# EAGLE design sensor_board (EAGLE 7.2.0)
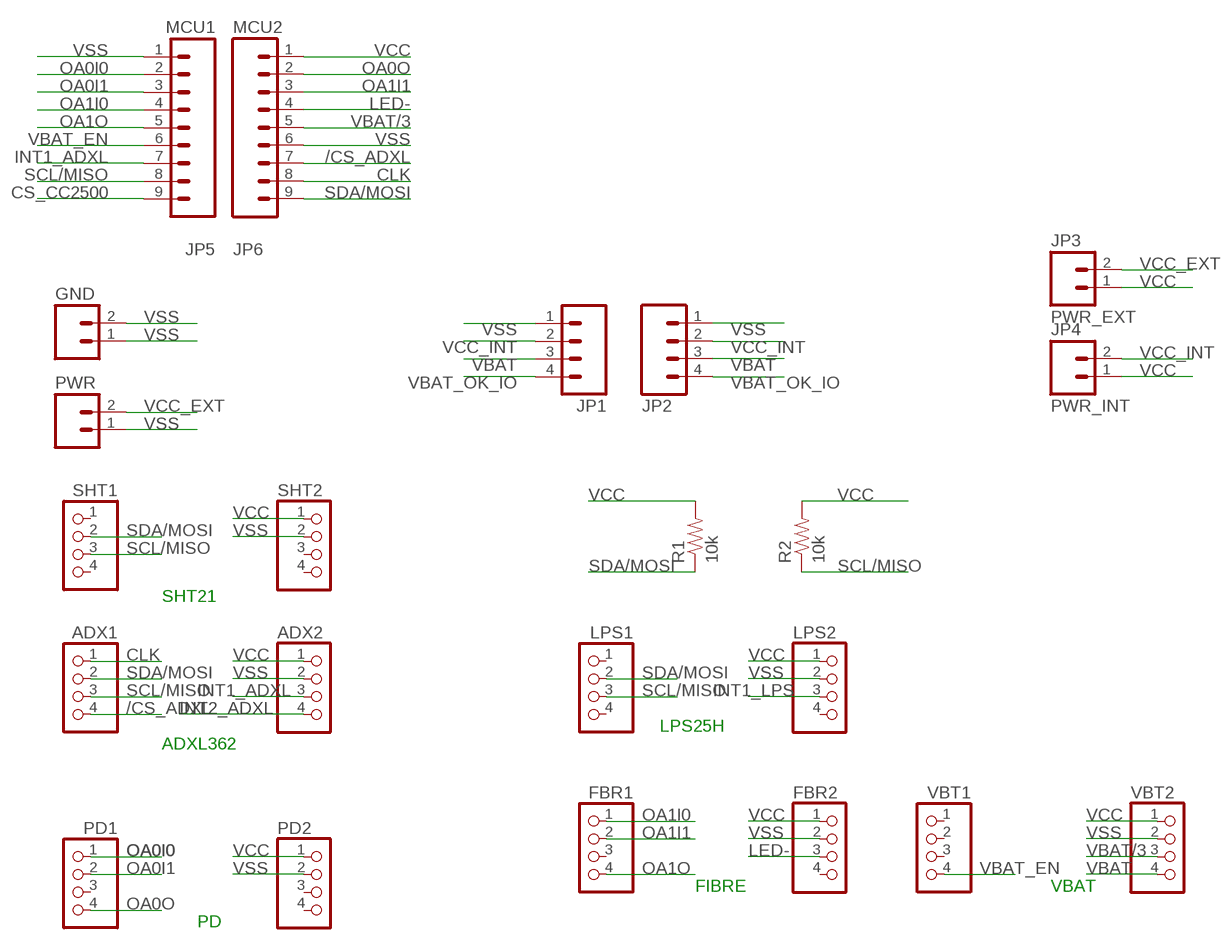
[diagram p0: schematic, sheet 1]

## Parts
ADX1  PINHD-1X4  [1X04]
ADX2  PINHD-1X4  [1X04]
FBR1  PINHD-1X4  [1X04]
FBR2  PINHD-1X4  [1X04]
GND  M02PTH  [1X02]
JP1  M04PTH  [1X04]
JP2  M04PTH  [1X04]
JP3  PWR_EXT  M02PTH  [1X02]
JP4  PWR_INT  M02PTH  [1X02]
JP5  MCU1  M09  [1X09]
JP6  MCU2  M09  [1X09]
LPS1  PINHD-1X4  [1X04]
LPS2  PINHD-1X4  [1X04]
PD1  PINHD-1X4  [1X04]
PD2  PINHD-1X4  [1X04]
PWR  M02PTH  [1X02]
R1  10k  10KOHM-1/4W5%(PTH)  [AXIAL-0.3]
R2  10k  10KOHM-1/4W5%(PTH)  [AXIAL-0.3]
SHT1  PINHD-1X4  [1X04]
SHT2  PINHD-1X4  [1X04]
VBT1  PINHD-1X4  [1X04]
VBT2  PINHD-1X4  [1X04]

## Nets
/CS_ADXL: ADX1.4 JP6.7
CLK: ADX1.1 JP6.8
CS_CC2500: JP5.9
INT1_ADXL: ADX2.3 JP5.7
INT1_LPS: LPS2.3
INT2_ADXL: ADX2.4
LED-: FBR2.3 JP6.4
OA0I0: JP5.2 PD1.1
OA0I1: JP5.3 PD1.2
OA0O: JP6.2 PD1.4
OA1I0: FBR1.1 JP5.4
OA1I1: FBR1.2 JP6.3
OA1O: FBR1.4 JP5.5
SCL/MISO: ADX1.3 JP5.8 LPS1.3 R2.P$1 SHT1.3
SDA/MOSI: ADX1.2 JP6.9 LPS1.2 R1.P$1 SHT1.2
VBAT: JP1.3 JP2.3 VBT2.4
VBAT/3: JP6.5 VBT2.3
VBAT_EN: JP5.6 VBT1.4
VBAT_OK_IO: JP1.4 JP2.4
VCC: ADX2.1 FBR2.1 JP3.1 JP4.1 JP6.1 LPS2.1 PD2.1 R1.P$2 R2.P$2 SHT2.1 VBT2.1
VCC_EXT: JP3.2 PWR.2
VCC_INT: JP1.2 JP2.2 JP4.2
VSS: ADX2.2 FBR2.2 GND.1 GND.2 JP1.1 JP2.1 JP5.1 JP6.6 LPS2.2 PD2.2 PWR.1 SHT2.2 VBT2.2
Unconnected: FBR1.3 FBR2.4 LPS1.1 LPS1.4 LPS2.4 PD1.3 PD2.3 PD2.4 SHT1.1 SHT1.4 SHT2.3 SHT2.4 VBT1.1 VBT1.2 VBT1.3

## Notes on the sheet
- SHT21
- LPS25H
- ADXL362
- FIBRE | VBAT
- PD

## Library data of the parts
ADX1 ADX2 FBR1 FBR2 LPS1 LPS2 PD1 PD2 SHT1 SHT2 VBT1 VBT2 = pinhead:PINHD-1X4: PIN HEADER
GND JP3 JP4 PWR = passive_components:M02: Standard 2-pin 0.1" header. Use with - straight break away headers ( PRT-00116) - right angle break away headers (PRT-00553) - swiss pins (PRT-00743) - machine pins (PRT-00117) - female headers (PRT-00115) Molex polarized connector foot print use with: PRT-08233 with associated crimp pins and housings. 2.54_SCREWTERM for use with PRT-10571. 3.5mm Screw Terminal footprints for PRT-08084 5mm Screw Terminal footprints for use with PRT-08432
JP1 JP2 = passive_components:M04: Header 4 Standard 4-pin 0.1" header. Use with straight break away headers (SKU : PRT-00116), right angle break away headers (PRT-00553), swiss pins (PRT-00743), machine pins (PRT-00117), and female headers (PRT-00115). Molex polarized connector foot print use with SKU : PRT-08231 with associated crimp pins and housings. 1MM SMD Version SKU: PRT-10208
JP5 = SparkFun-Connectors:M09: Header 9 Standard 9-pin 0.1" header. Use with straight break away headers (SKU : PRT-00116), right angle break away headers (PRT-00553), swiss pins (PRT-00743), machine pins (PRT-00117), and female headers (PRT-00115).
JP6 = passive_components:M09: Header 9 Standard 9-pin 0.1" header. Use with straight break away headers (SKU : PRT-00116), right angle break away headers (PRT-00553), swiss pins (PRT-00743), machine pins (PRT-00117), and female headers (PRT-00115).
R1 R2 = SparkFun-Resistors:10KOHM-1/4W5%(PTH): RES-09435; PROD_ID: RES-9435

## Board
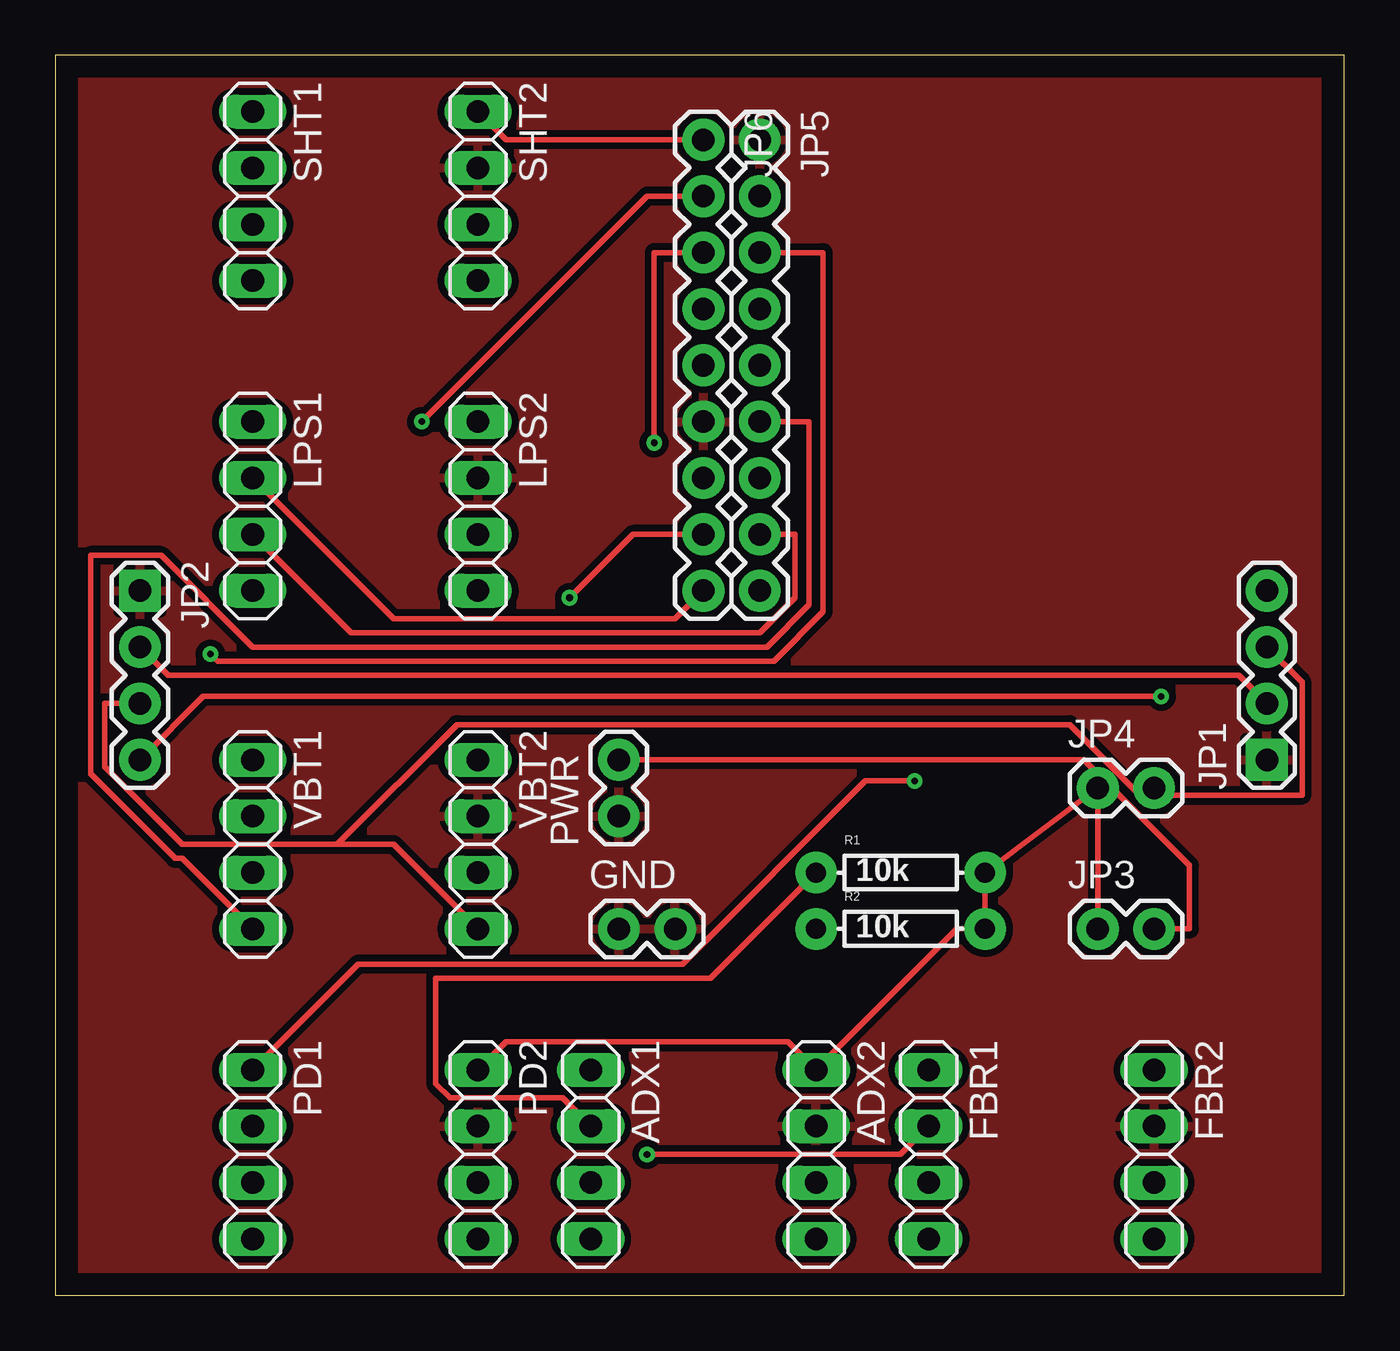
[diagram p1: board, top side]
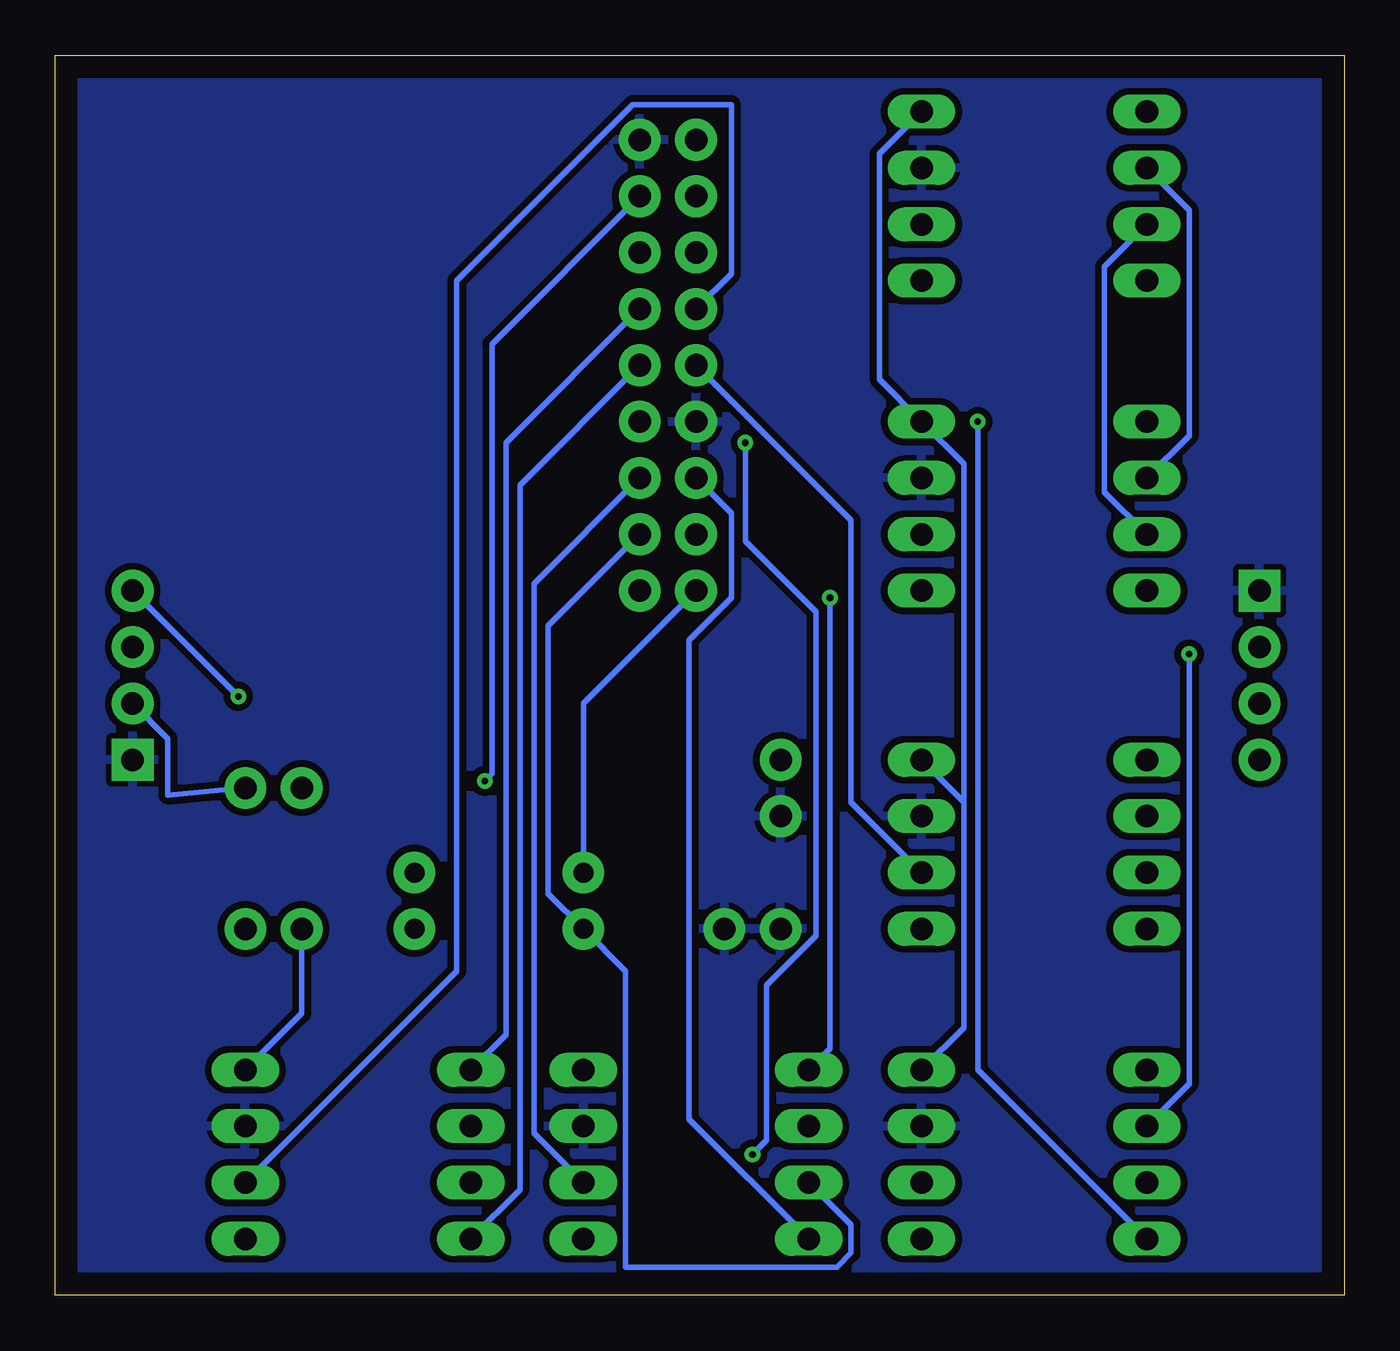
[diagram p2: board, bottom side, seen from below]

Size 58.09 x 55.87 mm. Coordinates in mm from the lower left corner, seen from the top.
Outline: 0,0 58.09,0 58.09,55.87 0,55.87 0,0
Copper layers (1*16): Top 0.035mm / dielectric 1.5mm / Bottom 0.035mm
Design rules "UoM_design_rules": minimum track width 0.25mm, minimum drill 0.3mm, track to track 0.25mm, track to pad 0.25mm, pad to pad 0.25mm, via to via 0.25mm, smd to smd 8mil, copper to edge 40mil, drill to drill 8mil, minimum pad ring 10mil, minimum via ring 8mil, stop-mask expansion 4mil, vias tented up to drill 0mil, thermal gap 10mil

### Footprints (pad centres in the part's own frame; a part is rotated, then mirrored left to right if it is on the bottom)
1X04 = drill 1.016 long: 1 -3.81,0; 2 -1.27,0; 3 1.27,0; 4 3.81,0
1X02 = drill 1.016 pad 1.88: 1 -1.27,0; 2 1.27,0
1X04' = drill 1.016 pad 1.88 square: 1 -3.81,0 | drill 1.016 pad 1.88: 2 -1.27,0; 3 1.27,0; 4 3.81,0
1X09 = drill 1.016 pad 1.88: 1 -10.16,0; 2 -7.62,0; 3 -5.08,0; 4 -2.54,0; 5 0,0; 6 2.54,0; 7 5.08,0; 8 7.62,0; 9 10.16,0
AXIAL-0.3 = drill 0.9 pad 1.88: P$1 -3.81,0; P$2 3.81,0

### Placement (x,y rotation side)
ADX1  24.13,6.35 270 top
ADX2  34.29,6.35 270 top
FBR1  39.37,6.35 270 top
FBR2  49.53,6.35 270 top
GND  26.67,16.51 0 top
JP1  [1X04']  54.61,27.94 90 top
JP2  [1X04']  3.81,27.94 270 top
JP3  48.26,16.51 0 top
JP4  48.26,22.86 0 top
JP5  31.75,41.91 270 top
JP6  29.21,41.91 270 top
LPS1  8.89,35.56 270 top
LPS2  19.05,35.56 270 top
PD1  8.89,6.35 270 top
PD2  19.05,6.35 270 top
PWR  25.4,22.86 90 top
R1  38.1,19.05 0 top
R2  38.1,16.51 0 top
SHT1  8.89,49.53 270 top
SHT2  19.05,49.53 270 top
VBT1  8.89,20.32 270 top
VBT2  19.05,20.32 270 top

### Tracks (layer width: path | path; a pad name or v marks a point on that pad's centre or on a via)
/CS_ADXL
  Bottom 0.25: ADX1.4 29.53,7.94 29.53,29.53 27.62,31.43 27.62,35.24 JP6.7
CLK  (via drill 0.3)
  Top 0.25: v23.18,31.43 26.04,34.29 JP6.8
  Bottom 0.25: ADX1.1 23.18,11.11 v23.18,31.43
INT1_ADXL
  Bottom 0.25: ADX2.3 36.51,7.3 36.51,32.07 JP5.7
LED-
  Bottom 0.25: FBR2.3 40.01,14.61 40.01,45.72 32.07,53.66 27.62,53.66 27.62,46.04 JP6.4
OA0I0  (via drill 0.3)
  Top 0.25: PD1.1 13.65,14.92 28.26,14.92 36.51,23.18 v38.74,23.18
  Bottom 0.25: v38.74,23.18 38.42,23.5 38.42,42.86 JP5.2
OA0I1  (via drill 0.3)
  Top 0.25: v6.98,28.89 7.3,28.57 32.38,28.57 34.61,30.8 34.61,46.99 JP5.3
  Bottom 0.25: PD1.2 6.98,9.53 v6.98,28.89
OA0O  (via drill 0.3)
  Top 0.25: v16.51,39.37 26.67,49.53 JP6.2
  Bottom 0.25: PD1.4 16.51,10.16 v16.51,39.37
OA1I0
  Bottom 0.25: FBR1.1 37.78,11.75 37.78,38.42 JP5.4
OA1I1  (via drill 0.3)
  Top 0.25: FBR1.2 38.1,6.35 v26.67,6.35 | v26.99,38.42 26.99,46.99 JP6.3
  Bottom 0.25: v26.67,6.35 26.04,6.98 26.04,13.97 23.81,16.19 23.81,30.8 26.99,33.97 v26.99,38.42
OA1O
  Bottom 0.25: FBR1.4 37.15,4.76 37.15,36.51 JP5.5
SCL/MISO
  Top 0.25: LPS1.3 13.33,29.84 31.75,29.84 33.34,31.43 33.34,34.29 JP5.8
  Bottom 0.25: LPS1.3 10.79,36.2 10.79,46.36 SHT1.3 | ADX1.3 22.22,3.17 22.22,1.91 22.86,1.27 32.38,1.27 32.38,14.61 R2.P$1 35.88,18.1 35.88,30.16 JP5.8
SDA/MOSI
  Top 0.25: ADX1.2 22.86,8.89 17.78,8.89 17.14,9.53 17.14,14.29 29.53,14.29 R1.P$1 | LPS1.2 15.24,30.48 27.94,30.48 JP6.9
  Bottom 0.25: LPS1.2 6.98,38.74 6.98,48.9 SHT1.2 | JP6.9 34.29,26.67 R1.P$1
VBAT
  Top 0.25: VBT2.4 15.24,20.32 12.7,20.32 | 12.7,20.32 5.71,20.32 2.22,23.81 2.22,26.67 JP2.3 | JP1.3 56.2,27.62 56.2,22.54 48.9,22.54 45.72,25.72 18.1,25.72 12.7,20.32
VBAT/3
  Bottom 0.25: VBT2.3 22.22,22.22 22.22,34.93 JP6.5
VBAT_EN
  Top 0.25: VBT1.4 5.71,19.68 5.4,19.68 1.59,23.5 1.59,33.34 4.76,33.34 8.89,29.21 32.07,29.21 33.97,31.11 33.97,39.37 JP5.6
VBAT_OK_IO  (via drill 0.3)
  Top 0.25: JP2.4 6.67,26.99 v49.85,26.99
  Bottom 0.25: JP1.4 v49.85,26.99
VCC
  Top 0.25: JP3.1 JP4.1 R1.P$2 R2.P$2 40.64,16.51 ADX2.1 33.02,11.43 20.32,11.43 PD2.1 | SHT2.1 20.32,52.07 JP6.1
  Bottom 0.25: FBR2.1 46.99,12.7 JP3.1 | PD2.1 17.14,12.06 17.14,22.22 | VBT2.1 17.14,22.22 | 17.14,22.22 17.14,37.47 LPS2.1 20.95,41.28 20.95,51.44 SHT2.1
VCC_EXT
  Top 0.25: PWR.2 46.36,24.13 51.12,19.37 51.12,16.51 JP3.2
VCC_INT
  Top 0.25: JP2.2 5.08,27.94 53.34,27.94 JP1.2
  Bottom 0.25: JP4.2 53.02,22.54 53.02,25.08 JP1.2
VSS
  pour Bottom (isolate 0.305, rank 6): 66.04,59.69 -48.26,58.42 -45.72,0 64.77,-6.35
  pour Top (isolate 0.305): -17.78,64.77 77.47,59.69 78.74,-8.89 -16.51,-3.81